# Altium schematic sheet [004] Charger.SchDoc
size A4
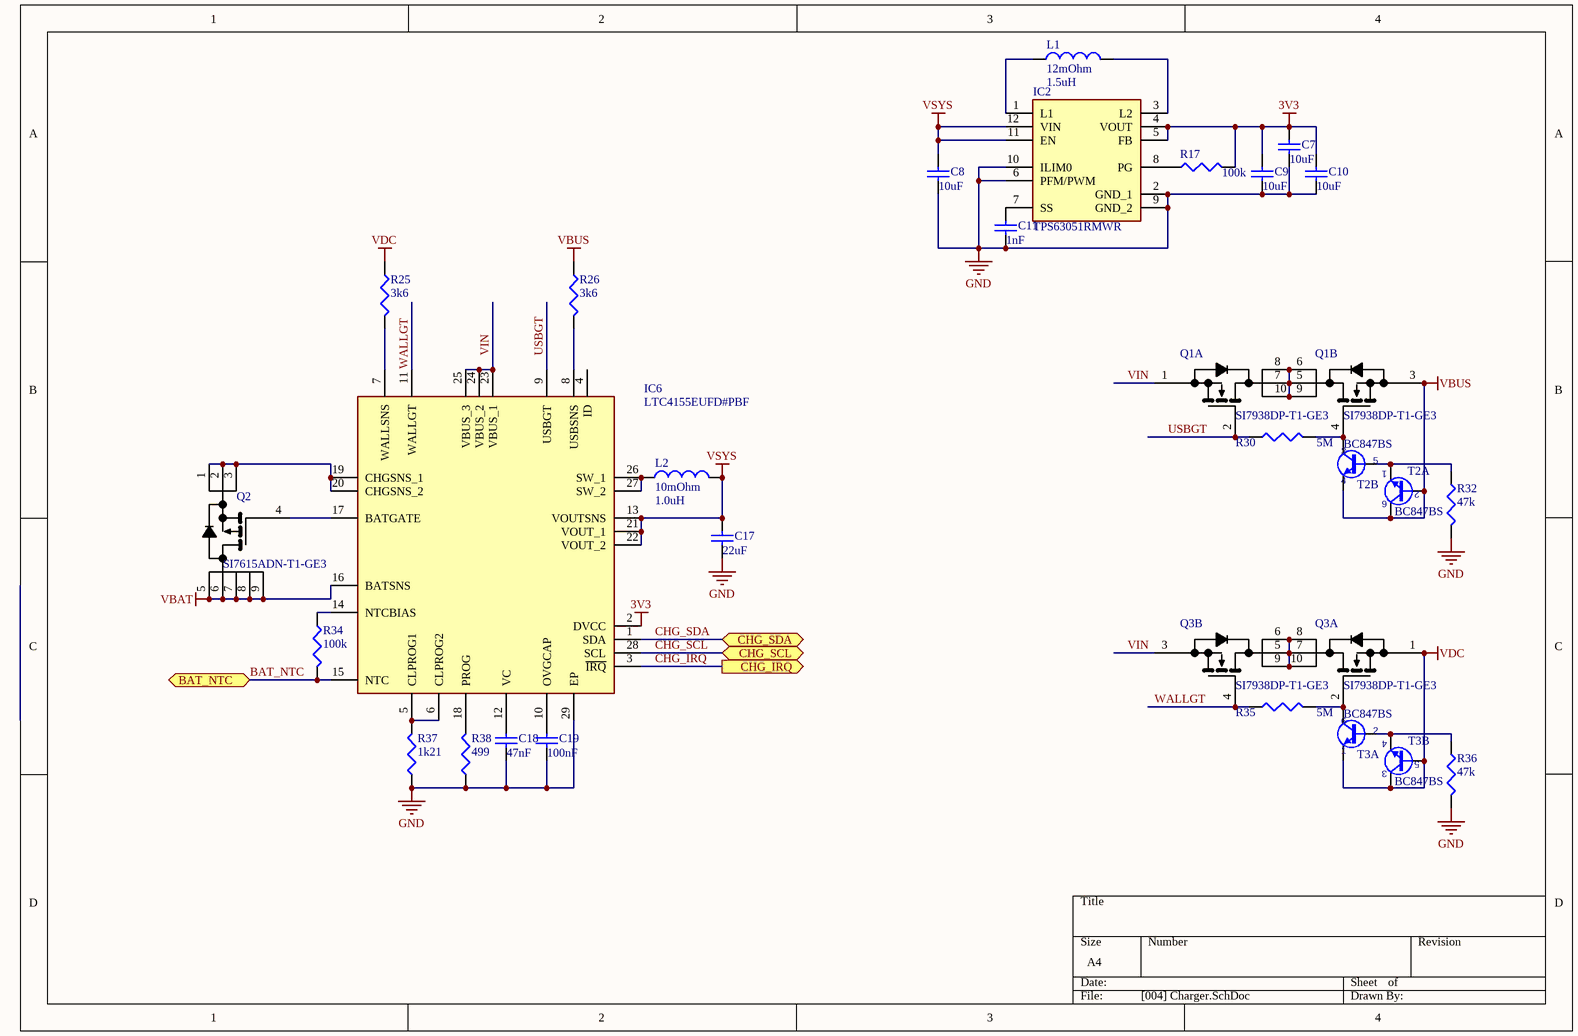
[diagram p0: [004] Charger.SchDoc]

## Parts
C7  value 10uF  [1608[0603]]  (hidden comment: Cap Semi)
C8  value 10uF  [1608[0603]]  (hidden comment: Cap Semi)
C9  value 10uF  [1608[0603]]  (hidden comment: Cap Semi)
C10  value 10uF  [1608[0603]]  (hidden comment: Cap Semi)
C11  value 1nF  [1608[0603]]  (hidden comment: Cap Semi)
C17  value 22uF  [1608[0603]]  (hidden comment: Cap Semi)
C18  value 47nF  [1608[0603]]  (hidden comment: Cap Semi)
C19  value 100nF  [1608[0603]]  (hidden comment: Cap Semi)
IC2  TPS63051RMWR  [QFN50P250X250X100-12N-D]
IC6  LTC4155EUFD#PBF  [QFN50P400X500X80-29N-D]
L1  12mOhm  value 1.5uH  [INDP2523X23N]
L2  10mOhm  value 1.0uH  [INDP2523X23N]
Q1  SI7938DP-T1-GE3  [POWERPAK-SO8_1]  (parts A,B of 2)
Q2  SI7615ADN-T1-GE3  [PowerPAK1212-8 Single]
Q3  SI7938DP-T1-GE3  [POWERPAK-SO8_1]  (parts A,B of 2)
R17  value 100k  [J1-0603]  (hidden comment: Res3)
R25  value 3k6  [J1-0603]  (hidden comment: Res3)
R26  value 3k6  [J1-0603]  (hidden comment: Res3)
R30  value 5M  [J1-0603]  (hidden comment: Res3)
R32  value 47k  [J1-0603]  (hidden comment: Res3)
R34  value 100k  [J1-0603]  (hidden comment: Res3)
R35  value 5M  [J1-0603]  (hidden comment: Res3)
R36  value 47k  [J1-0603]  (hidden comment: Res3)
R37  value 1k21  [J1-0603]  (hidden comment: Res3)
R38  value 499  [J1-0603]  (hidden comment: Res3)
T2  BC847BS  [SOT65P210X110-6N]  (parts A,B of 2)
T3  BC847BS  [SOT65P210X110-6N]  (parts A,B of 2)

## Ports
BAT_NTC (bidir), CHG_IRQ (out), CHG_SCL (bidir), CHG_SDA (bidir)

## Nets
3V3: C7.2 C9.2 C10.2 IC2.4(VOUT) IC2.5(FB) IC6.2(DVCC) R17.2
GND: C7.1 C8.1 C9.1 C10.1 C11.1 C17.1 C18.1 C19.1 IC2.2(GND_1) IC2.6(PFM/PWM) IC2.9(GND_2) IC2.10(ILIM0) IC6.29(EP) R32.2 R36.2 R37.1 R38.1
VBAT: IC6.16(BATSNS) Q2.5(D) Q2.6(D) Q2.7(D) Q2.8(D) Q2.9(D)
VBUS: Q1.3(S2) R26.1 T2.2(B) T2.4(E) T2.6(C)
VDC: Q3.1(S1) R25.1 T3.1(E) T3.3(C) T3.5(B)
VSYS: C8.2 C17.2 IC2.11(EN) IC2.12(VIN) IC6.13(VOUTSNS) IC6.21(VOUT_1) IC6.22(VOUT_2) L2.2
BAT_NTC: IC6.15(NTC) R34.2 ; port BAT_NTC
CHG_IRQ: IC6.3(~{IRQ}) ; port CHG_IRQ
CHG_SCL: IC6.28(SCL) ; port CHG_SCL
CHG_SDA: IC6.1(SDA) ; port CHG_SDA
USBGT: IC6.9(USBGT) Q1.2(G1) R30.1
VIN: IC6.23(VBUS_1) IC6.24(VBUS_2) IC6.25(VBUS_3) Q1.1(S1) Q3.3(S2)
WALLGT: IC6.11(WALLGT) Q3.4(G2) R35.1
NetC11_2: C11.2 IC2.7(SS)
NetC18_2: C18.2 IC6.12(VC)
NetC19_2: C19.2 IC6.10(OVGCAP)
NetIC2_1: IC2.1(L1) L1.1
NetIC2_3: IC2.3(L2) L1.2
NetIC2_8: IC2.8(PG) R17.1
NetIC6_5: IC6.5(CLPROG1) IC6.6(CLPROG2) R37.2
NetIC6_7: IC6.7(WALLSNS) R25.2
NetIC6_8: IC6.8(USBSNS) R26.2
NetIC6_14: IC6.14(NTCBIAS) R34.1
NetIC6_17: IC6.17(BATGATE) Q2.4(G)
NetIC6_18: IC6.18(PROG) R38.2
NetIC6_19: IC6.19(CHGSNS_1) IC6.20(CHGSNS_2) Q2.1(S) Q2.2(S) Q2.3(S)
NetIC6_26: IC6.26(SW_1) IC6.27(SW_2) L2.1
NetQ1_4: Q1.4(G2) R30.2 T2.3(C)
NetQ1_5: Q1.5(D2_1) Q1.6(D2_2) Q1.7(D1_1) Q1.8(D1_2) Q1.9(D2_3) Q1.10(D1_3)
NetQ3_2: Q3.2(G1) R35.2 T3.6(C)
NetQ3_5: Q3.5(D2_1) Q3.6(D2_2) Q3.7(D1_1) Q3.8(D1_2) Q3.9(D2_3) Q3.10(D1_3)
NetR32_1: R32.1 T2.1(E) T2.5(B)
NetR36_1: R36.1 T3.2(B) T3.4(E)

Not connected (* = marked no-connect by the designer): IC6 4(ID)

## Library data of the parts
C7-C11 C17-C19 = Cap Semi: Capacitor (Semiconductor SIM Model); Published: 8-Jun-2000; LatestRevisionDate: 29-May-2009; LatestRevisionNote: IPC-7351 Footprint Added.; PackageReference: C1206; Publisher: Altium Limited; PackageDescription: Chip Capacitor
IC2 = TPS63051RMWR: Integrated Circuit; Manufacturer_Name: Texas Instruments; Datasheet Link: http://www.ti.com/lit/gpn/tps63051; Height: 1mm; Manufacturer_Part_Number: TPS63051RMWR; ComponentLink1Description: TPS6305x Datasheet; ComponentLink1URL: http://www.ti.com/lit/ds/symlink/tps63051.pdf
IC6 = LTC4155EUFD#PBF: Integrated Circuit; Manufacturer_Name: Linear Technology; Datasheet Link: http://www.analog.com/media/en/technical-documentation/data-sheets/4155fd.pdf; Height: 0.8mm; Manufacturer_Part_Number: LTC4155EUFD#PBF
L1 = Inductor: Inductor SRN6045TA-1R5Y; Code_IEC: 1005; Published: 8-Jun-2000; LatestRevisionDate: 29-May-2009; LatestRevisionNote: IPC-7351 Footprint Added.; PackageReference: 0402-A; Publisher: Altium Limited; PackageDescription: Chip Inductor; Code_JEITA: 0402; ComponentLink1Description: SRN6045TA-1R5Y (Mouser); ComponentLink1URL: https://pl.mouser.com/ProductDetail/Bourns/SRN6045TA-1R5Y?qs=sGAEpiMZZMsg%252By3WlYCkU3tyM9HcjVri8VL%2FIY%252BgGEQ%3D
L2 = Inductor: Inductor SRN6045TA-1R0Y; Code_IEC: 1005; Published: 8-Jun-2000; LatestRevisionDate: 29-May-2009; LatestRevisionNote: IPC-7351 Footprint Added.; PackageReference: 0402-A; Publisher: Altium Limited; PackageDescription: Chip Inductor; Code_JEITA: 0402; ComponentLink2Description: SRN6045-1R0Y (Mouser); ComponentLink2URL: pl.mouser.com/ProductDetail/Bourns/SRN6045-1R0Y?qs=sGAEpiMZZMsg%252By3WlYCkU0o4wAoqWTm0KET%2FFU%252BpntA%3D
Q1 Q3 = SI7938DP-T1-GE3: MOSFET (N-Channel); Manufacturer_Name: Vishay; Datasheet Link: https://www.vishay.com/docs/65365/si7938dp.pdf; Manufacturer_Part_Number: SI7938DP-T1-GE3
Q2 = SI7615ADN-T1-GE3: MOSFET (P-Channel); Manufacturer_Name: Vishay; Manufacturer_Part_Number: SIS413DN-T1-GE3; ComponentLink1Description: Mouser; ComponentLink1URL: https://pl.mouser.com/ProductDetail/Vishay-Siliconix/SI7615ADN-T1-GE3?qs=sGAEpiMZZMshyDBzk1%2FWi6E1PdrpaYNpUmwK%2FZj1bgw%3D; ComponentLink2Description: Datasheet; ComponentLink2URL: https://pl.mouser.com/datasheet/2/427/si7615cdn-1018932.pdf
R17 R25 R26 R30 R32 R34-R38 = Res3: Resistor; Published: 8-Jun-2000; LatestRevisionDate: 29-May-2009; LatestRevisionNote: IPC-7351 Footprint Added.; PackageReference: J1-0603; Publisher: Altium Limited; PackageDescription: Chip Resistor
T2 T3 = BC847BS: 45V 100mA Dual NPN General-Purpose Transistor; Manufacturer: NXP SEMICONDUCTORS; PressFit: No; Bonding: No; Part Number: BC847BS; Component Kind: Standard; Component Type: Standard; Device: BC847BS; PackageDescription: SOT363, SC-88, SOT, 0.65mm Pitch, 6 pin, 1.25mm W X 2.00mm L X 1.10mm H, IPC Medium Density; Part Description: 45V 100mA Dual NPN General-Purpose Transistor; Manufacturer Part Number: BC847BS; Pin Count: 6; Case: SOT363; Mounted: Yes; Socket: No; SMD: Yes; Sense: No; ComponentHeight: 1.1mm; HelpURL: \\cern.ch\dfs\Applications\Altium\Datasheets\BC847BS.pdf; Author: CERN DEM JMW; CreateDate: 10.07.2015; LatestRevisionDate: 10.07.2015